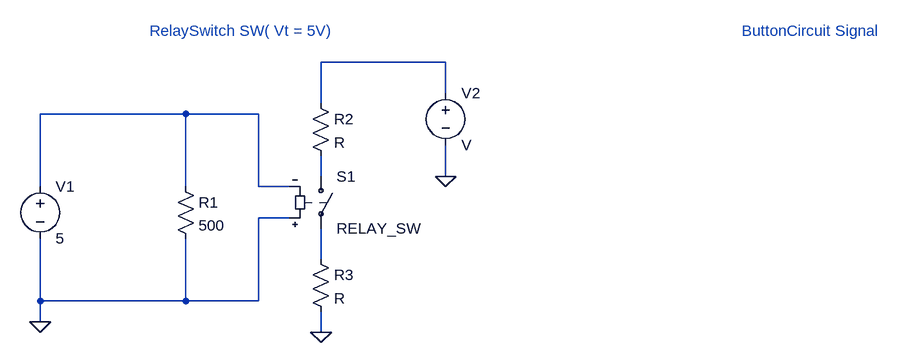
[diagram p0: schematic Final Project Schematic.asc]
Final Project Schematic.asc, the LTspice schematic file:
Version 4.1
SHEET 1 1252 680
WIRE 560 -96 368 -96
WIRE 560 -48 560 -96
WIRE 368 -32 368 -96
WIRE 160 -16 -64 -16
WIRE 272 -16 160 -16
WIRE 368 80 368 48
WIRE 560 80 560 32
WIRE -64 96 -64 -16
WIRE 160 96 160 -16
WIRE 272 96 272 -16
WIRE 320 96 272 96
WIRE 320 144 272 144
WIRE 368 208 368 160
WIRE -64 272 -64 176
WIRE 160 272 160 176
WIRE 160 272 -64 272
WIRE 272 272 272 144
WIRE 272 272 160 272
WIRE -64 304 -64 272
WIRE 368 320 368 288
FLAG 560 80 0
FLAG 368 320 0
FLAG -64 304 0
SYMBOL voltage -64 80 R0
WINDOW 123 0 0 Left 0
WINDOW 39 0 0 Left 0
SYMATTR InstName V1
SYMATTR Value 5
SYMBOL res 144 80 R0
SYMATTR InstName R1
SYMATTR Value 500
SYMBOL sw 368 64 R0
SYMATTR InstName S1
SYMATTR Value RELAY_SW
SYMBOL res 352 -48 R0
SYMATTR InstName R2
SYMBOL voltage 560 -64 R0
SYMATTR InstName V2
SYMBOL res 352 192 R0
SYMATTR InstName R3
TEXT 104 -144 Left 2 ;RelaySwitch SW( Vt = 5V)
TEXT 1016 -144 Left 2 ;ButtonCircuit Signal

The netlist it stands for:
* Final Project Schematic.asc
V1 N002 0 5
R1 N002 0 500
S1 N003 N004 0 N002 RELAY_SW
R2 N001 N003 R
V2 N001 0 V
R3 N004 0 R
* RelaySwitch SW( Vt = 5V)
* ButtonCircuit Signal
.backanno
.end